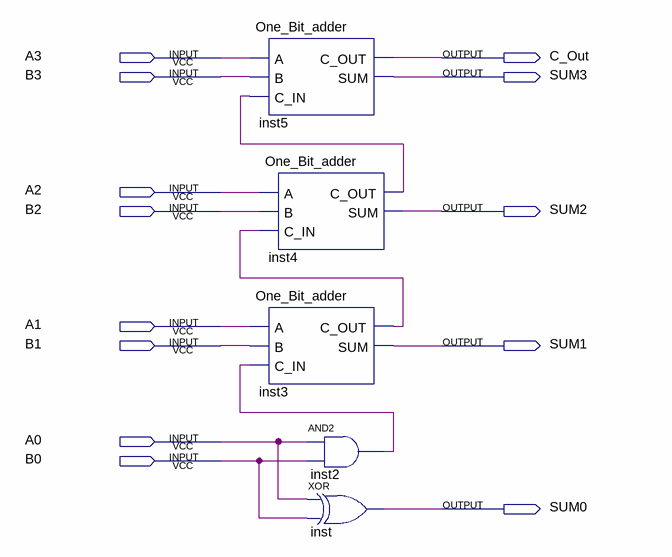
[diagram p0: schematic sheet]
// Quartus schematic 4_bit_adder.bdf as structural Verilog: 5 symbols, 13 pins
module \4_bit_adder  (
  input  A3,
  input  B3,
  input  A2,
  input  B2,
  input  A1,
  input  B1,
  input  A0,
  input  B0,
  output C_Out,
  output SUM3,
  output SUM2,
  output SUM1,
  output SUM0
);

  wire inst2_out, inst3_c_out, inst4_c_out;

  One_Bit_adder inst5 (.A(A3), .B(B3), .C_IN(inst4_c_out), .C_OUT(C_Out), .SUM(SUM3));
  One_Bit_adder inst4 (.A(A2), .B(B2), .C_IN(inst3_c_out), .C_OUT(inst4_c_out), .SUM(SUM2));
  One_Bit_adder inst3 (.A(A1), .B(B1), .C_IN(inst2_out), .C_OUT(inst3_c_out), .SUM(SUM1));
  and inst2 (inst2_out, A0, B0);
  xor inst (SUM0, A0, B0);
endmodule
